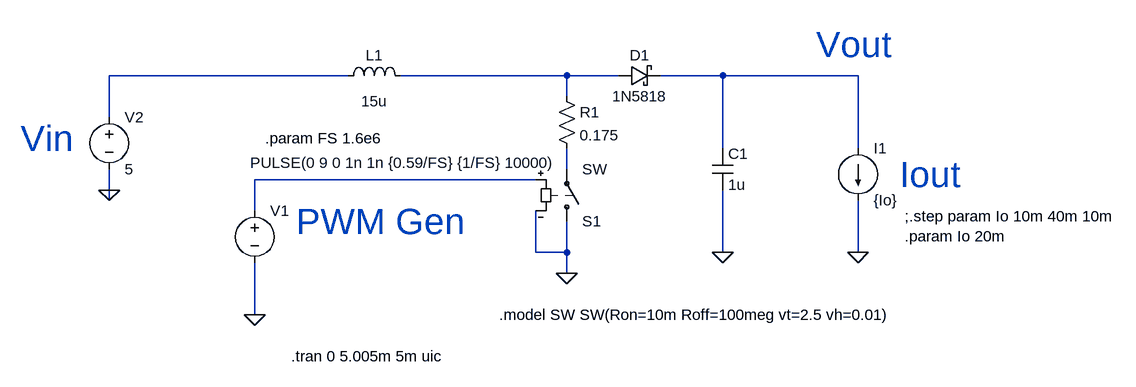
[diagram p0: schematic DC-DC Step up.asc]
DC-DC Step up.asc, the LTspice schematic file:
Version 4
SHEET 1 1448 680
WIRE 208 48 -160 48
WIRE 544 48 288 48
WIRE 624 48 544 48
WIRE 784 48 688 48
WIRE 992 48 784 48
WIRE 544 80 544 48
WIRE -160 112 -160 48
WIRE 784 160 784 48
WIRE 992 160 992 48
WIRE 544 192 544 160
WIRE 496 208 64 208
WIRE -160 224 -160 192
WIRE -160 240 -160 224
WIRE 64 256 64 208
WIRE 496 320 496 256
WIRE 544 320 544 272
WIRE 544 320 496 320
WIRE 784 320 784 224
WIRE 992 320 992 240
WIRE 544 352 544 320
WIRE 64 416 64 336
FLAG 544 352 0
FLAG 64 416 0
FLAG 784 320 0
FLAG 992 320 0
FLAG -160 224 0
SYMBOL voltage 64 240 R0
WINDOW 123 0 0 Left 2
WINDOW 39 0 0 Left 2
WINDOW 3 -7 -58 Left 2
SYMATTR Value PULSE(0 9 0 1n 1n {0.59/FS} {1/FS} 10000)
SYMATTR InstName V1
SYMBOL schottky 624 64 R270
WINDOW 0 32 32 VTop 2
WINDOW 3 0 32 VBottom 2
SYMATTR InstName D1
SYMATTR Value 1N5818
SYMATTR Description Diode
SYMATTR Type diode
SYMBOL ind 192 64 R270
WINDOW 0 32 56 VTop 2
WINDOW 3 -8 56 VBottom 2
SYMATTR InstName L1
SYMATTR Value 15u
SYMBOL cap 768 160 R0
SYMATTR InstName C1
SYMATTR Value 1u
SYMBOL current 992 160 R0
WINDOW 123 0 0 Left 2
WINDOW 39 0 0 Left 2
SYMATTR InstName I1
SYMATTR Value {Io}
SYMBOL voltage -160 96 R0
WINDOW 123 0 0 Left 2
WINDOW 39 0 0 Left 2
SYMATTR InstName V2
SYMATTR Value 5
SYMBOL sw 544 288 M180
SYMATTR InstName S1
SYMBOL res 528 64 R0
SYMATTR InstName R1
SYMATTR Value 0.175
TEXT 120 480 Left 2 !.tran 0 5.005m 5m uic
TEXT -296 144 Left 5 ;Vin
TEXT 1056 200 Left 5 ;Iout
TEXT 928 0 Left 5 ;Vout
TEXT 128 272 Left 5 ;PWM Gen
TEXT 440 416 Left 2 !.model SW SW(Ron=10m Roff=100meg vt=2.5 vh=0.01)
TEXT 80 144 Left 2 !.param FS 1.6e6
TEXT 1064 264 Left 2 !;.step param Io 10m 40m 10m\n.param Io 20m

The netlist it stands for:
* DC-DC Step up.asc
V1 N005 0 PULSE(0 9 0 1n 1n {0.59/FS} {1/FS} 10000)
D1 N002 N003 1N5818
L1 N001 N002 15u
C1 N003 0 1u
I1 N003 0 {Io}
V2 N001 0 5
S1 0 N004 N005 0 SW
R1 N002 N004 0.175
.model D D
.lib standard.dio
.tran 0 5.005m 5m uic
* Vin
* Iout
* Vout
* PWM Gen
.model SW SW(Ron=10m Roff=100meg vt=2.5 vh=0.01)
.param FS 1.6e6
;.step param Io 10m 40m 10m
.param Io 20m
.backanno
.end